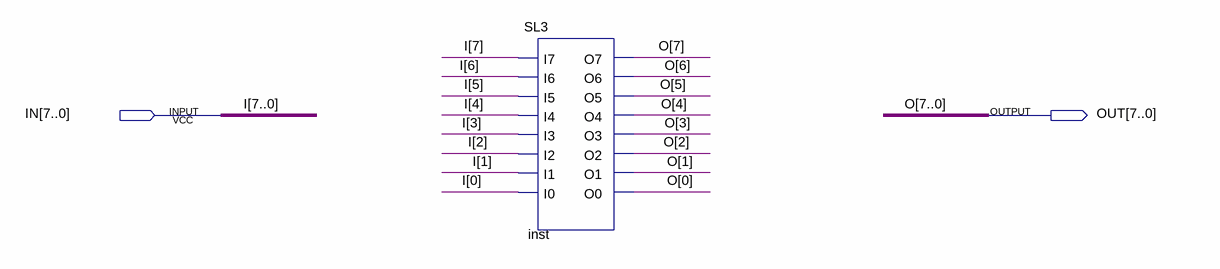
[diagram p0: schematic sheet]
// Quartus schematic MUL8.bdf as structural Verilog: 1 symbols, 2 pins
module MUL8 (
  input  [7:0] IN,
  output [7:0] OUT
);

  SL3 inst (
    .I7(IN[7]), .I6(IN[6]), .I5(IN[5]), .I4(IN[4]), .I3(IN[3]), .I2(IN[2]), .I1(IN[1]), .I0(IN[0]),
    .O7(OUT[7]), .O6(OUT[6]), .O5(OUT[5]), .O4(OUT[4]), .O3(OUT[3]), .O2(OUT[2]), .O1(OUT[1]), .O0(OUT[0]));

  // Other names for the same wires on the sheet: I[7:0] = IN; O[7:0] = OUT
endmodule
